# EasyEDA schematic SCH.json
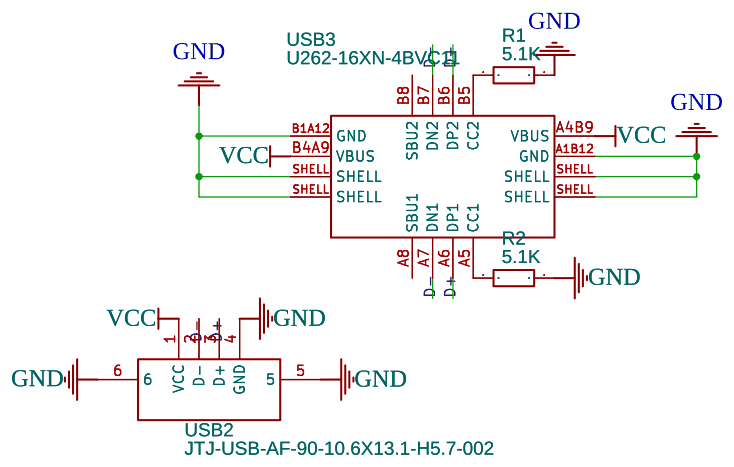
[diagram p0: schematic sheet]

## Parts
R1  5.1K  [R0402]
R2  5.1K  [R0402]
USB2  JTJ-USB-AF-90-10.6X13.1-H5.7-002  [USB-A-TH_C42425]
USB3  U262-16XN-4BVC11  [USB-3.1-SMD_U262-161N-4BVC11]

## Library data of the parts
R1 R2 = 0402WGF5101TCE: Supplier: LCSC; Manufacturer: UniOhm; Supplier Part: C25905; JLCPCB Part Class: Basic Part
USB2 = JTJ-USB-AF-90-10.6X13.1-H5.7-002: Supplier: LCSC; Supplier Part: C42425; Manufacturer: LCSC; Contributor: LCSC; JLCPCB Part Class: Extended Part
USB3 = U262-16XN-4BVC11: Supplier: LCSC; Supplier Part: C319148; Manufacturer: XKB Enterprise; Contributor: LCSC; JLCPCB Part Class: Extended Part

## Nets
GND: R1.1 R2.1 USB2.4(GND) USB2.5 USB2.6 USB3.A1B12(GND) USB3.B1A12(GND) USB3.SHELL
VCC: USB2.1(VCC) USB3.A4B9(VBUS) USB3.B4A9(VBUS)
D+: USB2.3(D+) USB3.A6(DP1) USB3.B6(DP2)
D-: USB2.2(D-) USB3.A7(DN1) USB3.B7(DN2)
Net-(R1-2): R1.2 USB3.B5(CC2)
Net-(R2-2): R2.2 USB3.A5(CC1)

Not connected (* = marked no-connect by the designer): USB3 A8(SBU1) B8(SBU2)
